# Altium project nfc-epd.PrjPcb
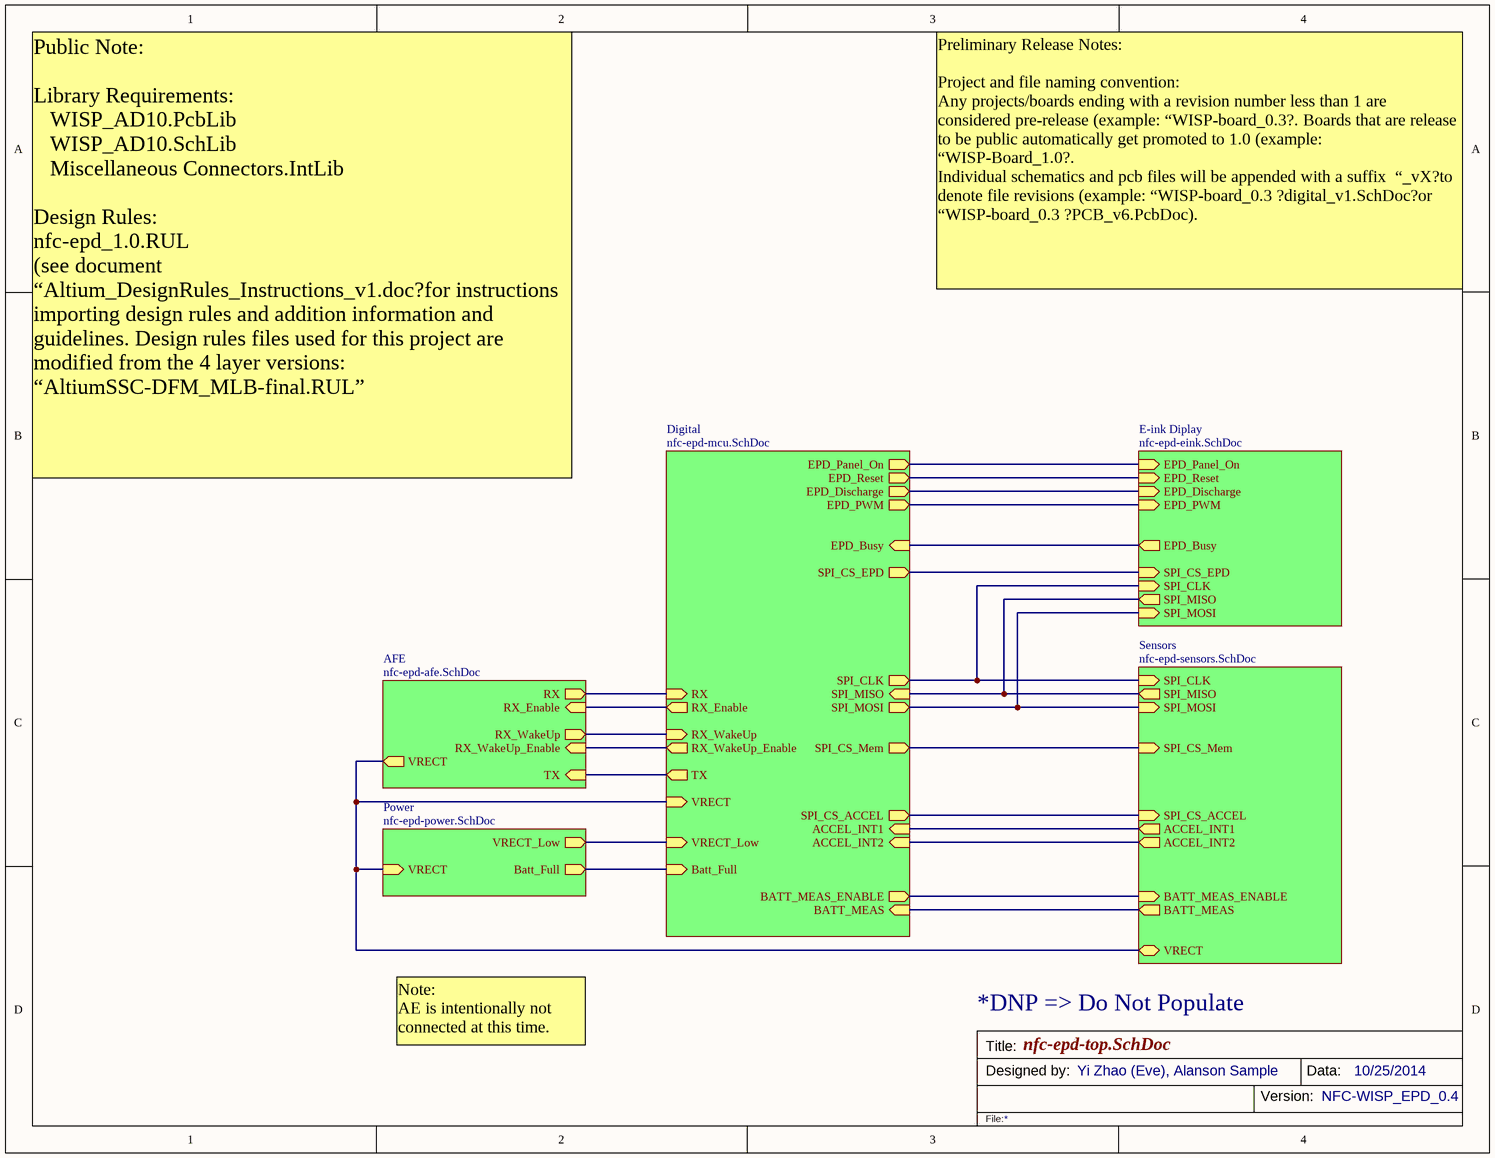
[diagram p0: nfc-epd-top.SchDoc]
6 sheets, 142 parts. Net scope: hierarchical (ports join the sheet entries above them; power ports are global).
Board file: nfc-epd.PcbDoc
Sheets:
  nfc-epd-top.SchDoc
    Digital = nfc-epd-mcu.SchDoc
    Sensors = nfc-epd-sensors.SchDoc
    Power = nfc-epd-power.SchDoc
    AFE = nfc-epd-afe.SchDoc
    E-ink Diplay = nfc-epd-eink.SchDoc

## Sheet nfc-epd-top.SchDoc
size Letter

### Sub-sheets
AFE = nfc-epd-afe.SchDoc: RX (out), TX (in), RX_Enable (in), RX_WakeUp (out), RX_WakeUp_Enable (in), VRECT (out)
Digital = nfc-epd-mcu.SchDoc: RX (in), TX (out), RX_Enable (out), SPI_MOSI (out), SPI_MISO (in), SPI_CLK (out), RX_WakeUp (in), RX_WakeUp_Enable (out), VRECT_Low (in), BATT_MEAS_ENABLE (out), BATT_MEAS (in), SPI_CS_EPD (out), EPD_Busy (in), EPD_Reset (out), EPD_Panel_On (out), EPD_Discharge (out), EPD_PWM (out), SPI_CS_Mem (out), Batt_Full (in), VRECT (in), ACCEL_INT1 (in), ACCEL_INT2 (in), SPI_CS_ACCEL (out)
E-ink Diplay = nfc-epd-eink.SchDoc: SPI_CS_EPD (in), EPD_Busy (out), SPI_CLK (in), SPI_MOSI (in), SPI_MISO (out), EPD_Reset (in), EPD_Panel_On (in), EPD_Discharge (in), EPD_PWM (in)
Power = nfc-epd-power.SchDoc: VRECT_Low (out), VRECT (in), Batt_Full (out)
Sensors = nfc-epd-sensors.SchDoc: VRECT, BATT_MEAS_ENABLE (in), BATT_MEAS (out), SPI_MOSI (in), SPI_MISO (out), SPI_CS_Mem (in), SPI_CLK (in), SPI_CS_ACCEL (in), ACCEL_INT1 (out), ACCEL_INT2 (out)

### Nets
ACCEL_INT1: sheet Digital/ACCEL_INT1, sheet Sensors/ACCEL_INT1
ACCEL_INT2: sheet Digital/ACCEL_INT2, sheet Sensors/ACCEL_INT2
Batt_Full: sheet Digital/Batt_Full, sheet Power/Batt_Full
BATT_MEAS: sheet Digital/BATT_MEAS, sheet Sensors/BATT_MEAS
BATT_MEAS_ENABLE: sheet Digital/BATT_MEAS_ENABLE, sheet Sensors/BATT_MEAS_ENABLE
EPD_Busy: sheet Digital/EPD_Busy, sheet E-ink Diplay/EPD_Busy
EPD_Discharge: sheet Digital/EPD_Discharge, sheet E-ink Diplay/EPD_Discharge
EPD_Panel_On: sheet Digital/EPD_Panel_On, sheet E-ink Diplay/EPD_Panel_On
EPD_PWM: sheet Digital/EPD_PWM, sheet E-ink Diplay/EPD_PWM
EPD_Reset: sheet Digital/EPD_Reset, sheet E-ink Diplay/EPD_Reset
RX: sheet Digital/RX, sheet AFE/RX
RX_ENABLE: sheet Digital/RX_Enable, sheet AFE/RX_Enable
RX_WakeUp: sheet Digital/RX_WakeUp, sheet AFE/RX_WakeUp
RX_WakeUp_Enable: sheet Digital/RX_WakeUp_Enable, sheet AFE/RX_WakeUp_Enable
SPI_CLK: sheet Digital/SPI_CLK, sheet Sensors/SPI_CLK, sheet E-ink Diplay/SPI_CLK
SPI_CS_ACCEL: sheet Digital/SPI_CS_ACCEL, sheet Sensors/SPI_CS_ACCEL
SPI_CS_EPD: sheet Digital/SPI_CS_EPD, sheet E-ink Diplay/SPI_CS_EPD
SPI_CS_Mem: sheet Digital/SPI_CS_Mem, sheet Sensors/SPI_CS_Mem
SPI_MISO: sheet Digital/SPI_MISO, sheet Sensors/SPI_MISO, sheet E-ink Diplay/SPI_MISO
SPI_MOSI: sheet Digital/SPI_MOSI, sheet Sensors/SPI_MOSI, sheet E-ink Diplay/SPI_MOSI
TX: sheet Digital/TX, sheet AFE/TX
VRECT: sheet Digital/VRECT, sheet Sensors/VRECT, sheet Power/VRECT, sheet AFE/VRECT
VRECT_Low: sheet Digital/VRECT_Low, sheet Power/VRECT_Low

### Notes on the sheet
- Preliminary Release Notes:
  Project and file naming convention:
  Any projects/boards ending with a revision number less than 1 are considered pre-release (example: “WISP-board_0.3?. Boards that are release to be public automatically get promoted to 1.0 (example: “WISP-Board_1.0?.
  Individual schematics and pcb files will be appended with a suffix  “_vX?to denote file revisions (example: “WISP-board_0.3 ?digital_v1.SchDoc?or “WISP-board_0.3 ?PCB_v6.PcbDoc).
- Public Note:
  Library Requirements:
  WISP_AD10.PcbLib
  WISP_AD10.SchLib
  Miscellaneous Connectors.IntLib
  Design Rules:
  nfc-epd_1.0.RUL
  (see document “Altium_DesignRules_Instructions_v1.doc?for instructions importing design rules and addition information and guidelines. Design rules files used for this project are modified from the 4 layer versions:  “AltiumSSC-DFM_MLB-final.RUL”
- Note:
  AE is intentionally not connected at this time.
- *DNP => Do Not Populate
- Title:
- Designed by:
- Yi Zhao (Eve), Alanson Sample
- Version:
- Data:
- NFC-WISP_EPD_0.4
- 10/25/2014
- File:

## Sheet nfc-epd-mcu.SchDoc
size Letter
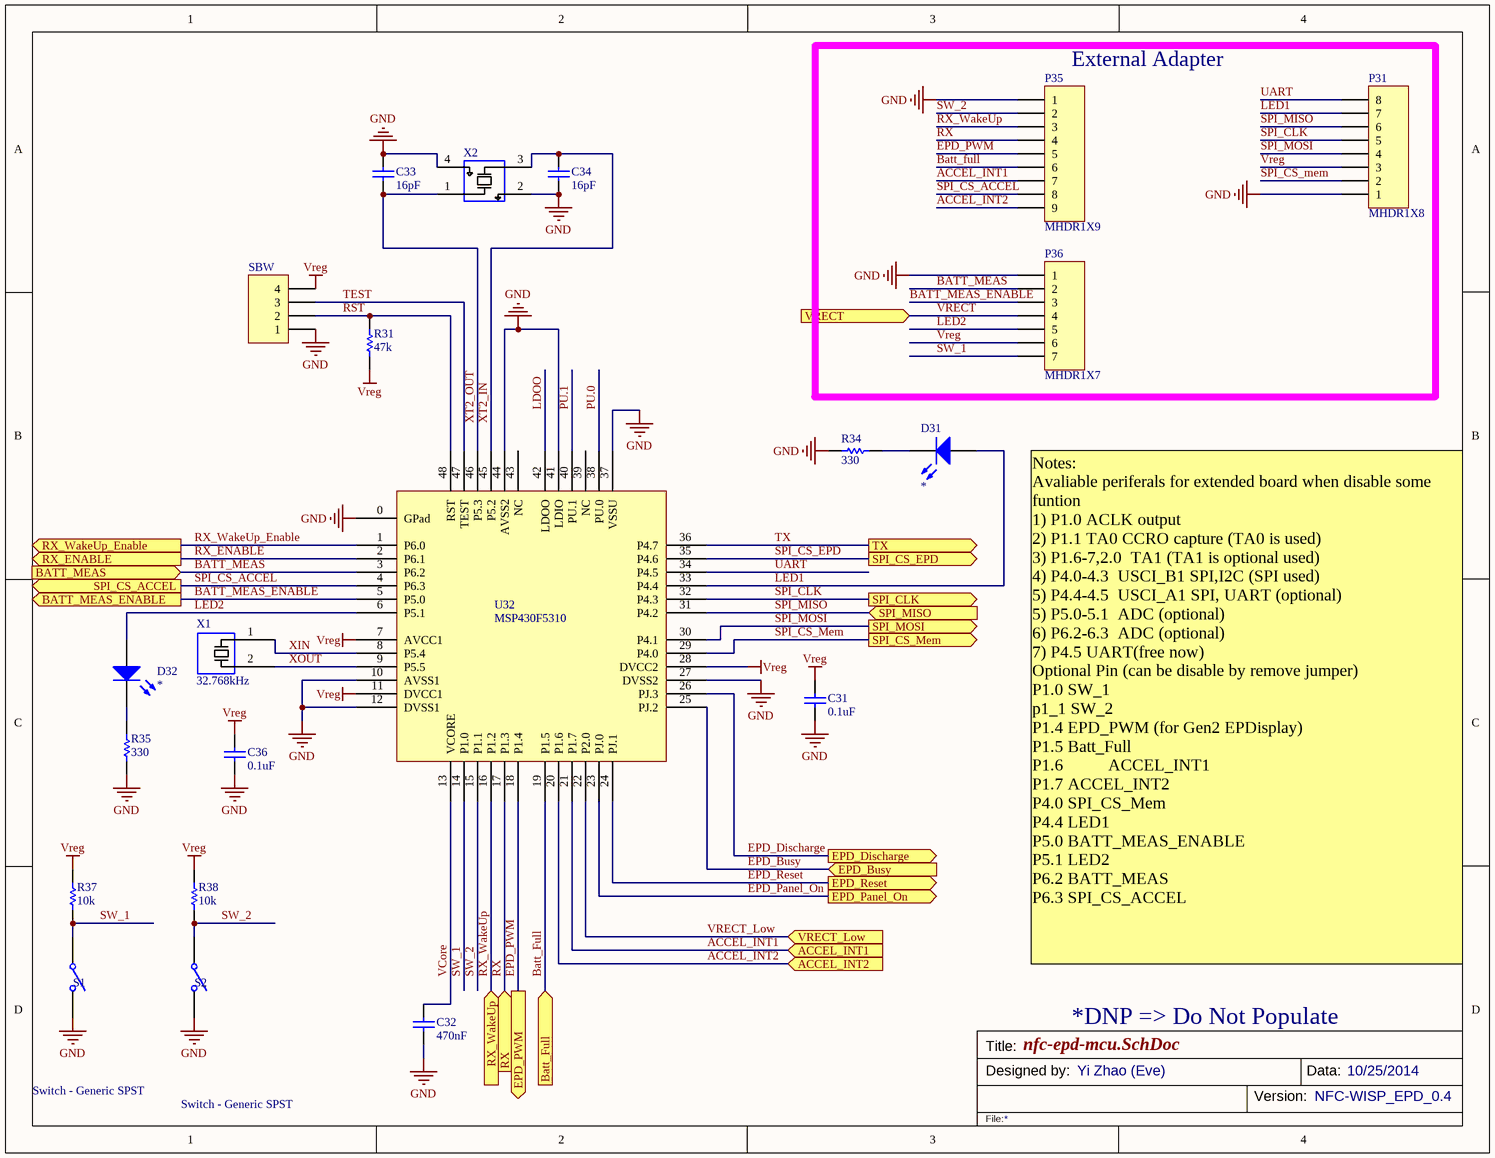
[diagram p1: nfc-epd-mcu.SchDoc]

### Parts
C31  value 0.1uF  [0603]  (hidden comment: Cap)
C32  value 470nF  [0603]  (hidden comment: Cap)
C33  value 16pF  [0603]  (hidden comment: Cap)
C34  value 16pF  [0603]  (hidden comment: Cap)
C36  value 0.1uF  [0402]  (hidden comment: Cap)
D31  LED  [Diode - 0603]  (value not drawn)
D32  LED  [Diode - 0603]  (value not drawn)
P31  MHDR1X8  [MHDR1X8]
P35  MHDR1X9  [MHDR1X9]
P36  MHDR1X7  [MHDR1X7]
R31  value 47k  [0603]  (hidden comment: Res)
R34  value 330  [0603]  (hidden comment: Res)
R35  value 330  [0603]  (hidden comment: Res)
R37  value 10k  [0603]  (hidden comment: Res)
R38  value 10k  [0603]  (hidden comment: Res)
S1  Switch - Generic SPST  [Switch - B3U-1000P]
S2  Switch - Generic SPST  [Switch - B3U-1000P]
SBW  MHDR1X4  [MHDR1X4]  (value not drawn)
U32  MSP430F5310  [48-QFN]
X1  value 32.768kHz  [XTAL - 2Pin [3.2mm x 1.5mm]]  (hidden comment: XTAL)
X2  XTAL 4pin  [XTAL - 4Pin [3.2MM X 2.5MM]]  (value not drawn)

### Blocks framed on the sheet
External Adapter: P31 P35 P36

### Ports
ACCEL_INT1 (in), ACCEL_INT2 (in), Batt_Full (in), BATT_MEAS (in), BATT_MEAS_ENABLE (out), EPD_Busy (in), EPD_Discharge (out), EPD_Panel_On (out), EPD_PWM (out), EPD_Reset (out), RX (in), RX_ENABLE (out), RX_WakeUp (in), RX_WakeUp_Enable (out), SPI_CLK (out), SPI_CS_ACCEL (out), SPI_CS_EPD (out), SPI_CS_Mem (out), SPI_MISO (in), SPI_MOSI (out), TX (out), VRECT (in), VRECT_Low (in)

### Nets
GND: C31.1 C32.2 C33.2 C34.1 C36.1 P31.1 P35.1 P36.1 R34.1 R35.1 S1.2(NO) S2.2(NO) SBW.1 U32.0(GPad) U32.10(AVSS1) U32.12(DVSS1) U32.27(DVSS2) U32.37(VSSU) U32.41(LDIO) U32.44(AVSS2) X2.2(Gnd) X2.4(Gnd)
Vreg: C31.2 C36.2 P31.3 P36.6 R31.2 R37.2 R38.2 SBW.4 U32.7(AVCC1) U32.11(DVCC1) U32.28(DVCC2)
ACCEL_INT1: P35.7 U32.21(P1.7) ; port ACCEL_INT1
ACCEL_INT2: P35.9 U32.20(P1.6) ; port ACCEL_INT2
Batt_Full: P35.6 U32.19(P1.5) ; port Batt_Full
BATT_MEAS: P36.2 U32.3(P6.2) ; port BATT_MEAS
BATT_MEAS_ENABLE: P36.3 U32.5(P5.0) ; port BATT_MEAS_ENABLE
EPD_Busy: U32.25(PJ.2) ; port EPD_Busy
EPD_Discharge: U32.26(PJ.3) ; port EPD_Discharge
EPD_Panel_On: U32.23(PJ.0) ; port EPD_Panel_On
EPD_PWM: P35.5 U32.18(P1.4) ; port EPD_PWM
EPD_Reset: U32.24(PJ.1) ; port EPD_Reset
LDOO: U32.42(LDOO)
LED1: D31.1(A) P31.7 U32.33(P4.4)
LED2: D32.1(A) P36.5 U32.6(P5.1)
PU.0: U32.38(PU.0)
PU.1: U32.40(PU.1)
RST: R31.1 SBW.2 U32.48(RST)
RX: P35.4 U32.17(P1.3) ; port RX
RX_ENABLE: U32.2(P6.1) ; port RX_ENABLE
RX_WakeUp: P35.3 U32.16(P1.2) ; port RX_WakeUp
RX_WakeUp_Enable: U32.1(P6.0) ; port RX_WakeUp_Enable
SPI_CLK: P31.5 U32.32(P4.3) ; port SPI_CLK
SPI_CS_ACCEL: P35.8 U32.4(P6.3) ; port SPI_CS_ACCEL
SPI_CS_EPD: U32.35(P4.6) ; port SPI_CS_EPD
SPI_CS_Mem: P31.2 U32.29(P4.0) ; port SPI_CS_Mem
SPI_MISO: P31.6 U32.31(P4.2) ; port SPI_MISO
SPI_MOSI: P31.4 U32.30(P4.1) ; port SPI_MOSI
SW_1: P36.7 R37.1 S1.1(COMMON) U32.14(P1.0)
SW_2: P35.2 R38.1 S2.1(COMMON) U32.15(P1.1)
TEST: SBW.3 U32.47(TEST)
TX: U32.36(P4.7) ; port TX
UART: P31.8 U32.34(P4.5)
VCore: C32.1 U32.13(VCORE)
VRECT: P36.4 ; port VRECT
VRECT_Low: U32.22(P2.0) ; port VRECT_Low
XIN: U32.8(P5.4) X1.1
XOUT: U32.9(P5.5) X1.2
XT2_IN: C34.2 U32.45(P5.2) X2.3(XOUT)
XT2_OUT: C33.1 U32.46(P5.3) X2.1(XIN)
NetD31_2: D31.2(K) R34.2
NetD32_2: D32.2(K) R35.2

Not connected (* = marked no-connect by the designer): U32 39(NC) 43(NC)

### Notes on the sheet
- Notes:
  Avaliable periferals for extended board when disable some funtion
  1) P1.0	ACLK output
  2) P1.1	TA0 CCRO capture (TA0 is used)
  3) P1.6-7,2.0  TA1 (TA1 is optional used)
  4) P4.0-4.3	 USCI_B1 SPI,I2C (SPI used)
  5) P4.4-4.5  USCI_A1 SPI, UART (optional)
  5) P5.0-5.1  ADC (optional)
  6) P6.2-6.3  ADC (optional)
  7) P4.5	UART(free now)
  Optional Pin (can be disable by remove jumper)
  P1.0	SW_1
  p1_1	SW_2
  P1.4	EPD_PWM (for Gen2 EPDisplay)
  P1.5	Batt_Full
  P1.6          ACCEL_INT1
  P1.7	ACCEL_INT2
  P4.0	SPI_CS_Mem
  P4.4	LED1
  P5.0	BATT_MEAS_ENABLE
  P5.1	LED2
  P6.2	BATT_MEAS
  P6.3	SPI_CS_ACCEL
- *DNP => Do Not Populate
- Title:
- Designed by:
- Yi Zhao (Eve)
- Version:
- Data:
- NFC-WISP_EPD_0.4
- 10/25/2014
- File:

### Library data of the parts
C31-C34 C36 = Cap: Ceramic Capacitor (Surface Mount); Manufacturer: Generic Ceramic Chip Cap (TBD); Digi-Key Part Number: *; Manufacturer Part Number: *; Note: *; Rating: *
D31 D32 = Diode - LED: Typical RED, GREEN, YELLOW, AMBER GaAs LED; Digi-Key Part Number: *; Manufacturer: *; Manufacturer Part Number: *; Note: *; Value: *; Rating: *
P31 = MHDR1X8: Header, 8-Pin; Manufacturer Part Number 1: 0603ZD105KAT2A; Note: DNP; LatestRevisionDate: 17-Jul-2002; LatestRevisionNote: Re-released for DXP Platform.; Publisher: Altium Limited
P35 = MHDR1X9: Header, 9-Pin; Note: DNP; LatestRevisionDate: 17-Jul-2002; LatestRevisionNote: Re-released for DXP Platform.; Publisher: Altium Limited
P36 = MHDR1X7: Header, 7-Pin; Note: DNP; LatestRevisionDate: 17-Jul-2002; LatestRevisionNote: Re-released for DXP Platform.; Publisher: Altium Limited
R31 R34 R35 R37 R38 = Res: Chip Resistor (Surface Mount); Manufacturer: Generic Chip Res (TBD); Manufacturer Part Number: *; Digi-Key Part Number: *; Rating: *; Note: *
S1 S2 = Switch - Generic SPST: Generic Single-Pole, Single-Throw Switch; Manufacturer: *; Digi-Key Part Number: *; Manufacturer Part Number: *; Note: *; Value: *; Rating: *; Supplier 1: Digi-Key; Supplier Part Number 1: SW1143CT-ND
SBW = MHDR1X4: Header, 4-Pin; LatestRevisionDate: 17-Jul-2002; LatestRevisionNote: Re-released for DXP Platform.; Publisher: Altium Limited
U32 = MSP430F5310 - 48Pin: MSP430 - 48LQFP or 48QFN; Manufacturer: Texas Instruments; Manufacturer Part Number: MSP430F5310IRGZ; Digi-Key Part Number: 296-28193-2-ND or 296-28133-1-ND; Rating: *; Value: *; Note: *; Supplier 1: Digi-Key; Supplier Part Number 1: 296-28133-1-ND
X1 = XTAL 2-pins: Crystal - 2-Pin Surface Mount; Manufacturer: Epson Toyocom Corporation; Manufacturer Part Number: FC-135 32.7680KA-A3; Digi-Key Part Number: example: SE2413CT-ND
X2 = XTAL 4-pins: Crystal - 4-Pin Surface Mount; Manufacturer Part Number 1: ABM8G-13.560MHZ-B4Y-T; Note: double check foot print; Rating: *; Value: *; Supplier 1: Digi-Key; Supplier Part Number 1: 535-10286-1-ND

## Sheet nfc-epd-sensors.SchDoc
size A
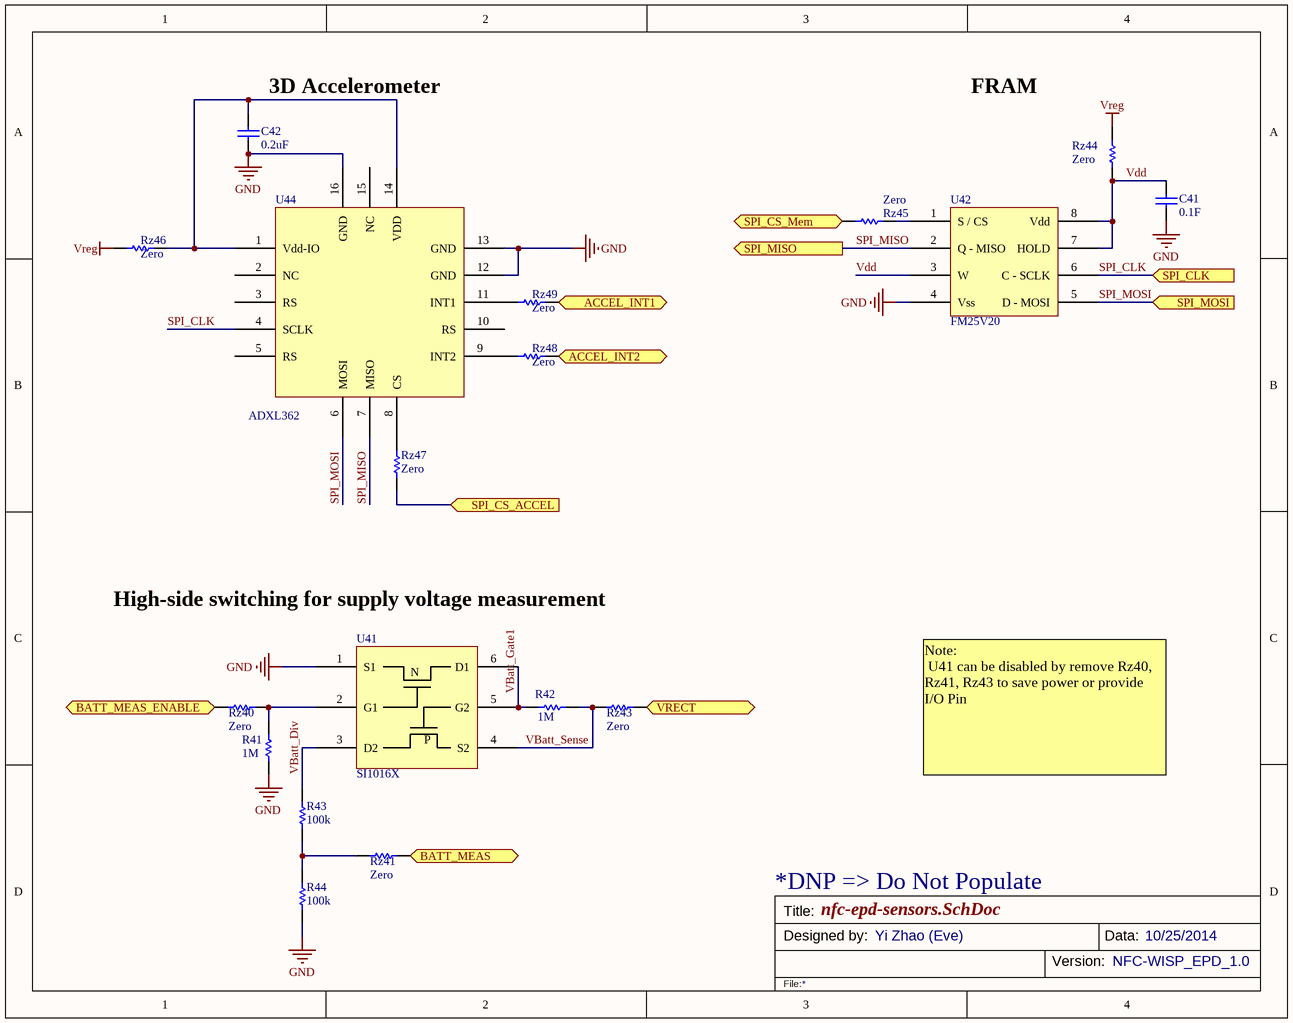
[diagram p2: nfc-epd-sensors.SchDoc]

### Parts
C41  value 0.1F  [0603]  (hidden comment: Cap)
C42  value 0.2uF  [0402]  (hidden comment: Cap)
R41  value 1M  [0603]  (hidden comment: Res)
R42  value 1M  [0603]  (hidden comment: Res)
R43  value 100k  [0603]  (hidden comment: Res)
R44  value 100k  [0603]  (hidden comment: Res)
Rz40  value Zero  [0603]  (hidden comment: Res)
Rz41  value Zero  [0603]  (hidden comment: Res)
Rz43  value Zero  [0603]  (hidden comment: Res)
Rz44  value Zero  [0603]  (hidden comment: Res)
Rz45  value Zero  [0603]  (hidden comment: Res)
Rz46  value Zero  [0603]  (hidden comment: Res)
Rz47  value Zero  [0603]  (hidden comment: Res)
Rz48  value Zero  [0603]  (hidden comment: Res)
Rz49  value Zero  [0603]  (hidden comment: Res)
U41  SI1016X  [SC-89-6 Vishay]
U42  FM25V20  [TDFN-8]
U44  ADXL362  [ADXL362 - Mod 6mil clearence]

### Ports
ACCEL_INT1 (out), ACCEL_INT2 (out), BATT_MEAS (out), BATT_MEAS_ENABLE (in), SPI_CLK (in), SPI_CS_ACCEL (in), SPI_CS_Mem (in), SPI_MISO (out), SPI_MOSI (in), VRECT (in)

### Nets
GND: C41.1 C42.2 R41.1 R44.1 U41.1(S1) U42.4(Vss) U44.12(GND) U44.13(GND) U44.16(GND)
Vreg: Rz44.1 Rz46.1
ACCEL_INT1: Rz49.2 ; port ACCEL_INT1
ACCEL_INT2: Rz48.2 ; port ACCEL_INT2
BATT_MEAS: Rz41.1 ; port BATT_MEAS
BATT_MEAS_ENABLE: Rz40.2 ; port BATT_MEAS_ENABLE
SPI_CLK: U42.6(C_-_SCLK) U44.4(SCLK) ; port SPI_CLK
SPI_CS_ACCEL: Rz47.1 ; port SPI_CS_ACCEL
SPI_CS_Mem: Rz45.1 ; port SPI_CS_Mem
SPI_MISO: U42.2(Q_-_MISO) U44.7(MISO) ; port SPI_MISO
SPI_MOSI: U42.5(D_-_MOSI) U44.6(MOSI) ; port SPI_MOSI
VBatt_Div: R43.2 U41.3(D2)
VBatt_Gate1: R42.2 U41.5(G2) U41.6(D1)
VBatt_Sense: R42.1 Rz43.2 U41.4(S2)
Vdd: C41.2 Rz44.2 U42.3(W) U42.7(HOLD) U42.8(Vdd)
VRECT: Rz43.1 ; port VRECT
NetC42_1: C42.1 Rz46.2 U44.1(Vdd-IO) U44.14(VDD)
NetR41_2: R41.2 Rz40.1 U41.2(G1)
NetR43_1: R43.1 R44.2 Rz41.2
NetRz45_2: Rz45.2 U42.1(S_/_CS)
NetRz47_2: Rz47.2 U44.8(CS)
NetRz48_1: Rz48.1 U44.9(INT2)
NetRz49_1: Rz49.1 U44.11(INT1)

Not connected (* = marked no-connect by the designer): U44 2(NC) 3(RS) 5(RS) 10(RS) 15(NC)

### Notes on the sheet
- (near C42) 3D Accelerometer
- FRAM
- High-side switching for supply voltage measurement
- Note:
  U41 can be disabled by remove Rz40, Rz41, Rz43 to save power or provide I/O Pin
- *DNP => Do Not Populate
- Title:
- Designed by:
- Yi Zhao (Eve)
- Version:
- Data:
- NFC-WISP_EPD_1.0
- 10/25/2014
- File:
- (in symbol SI1016X) N; P

### Library data of the parts
C41 C42 = Cap: as C31 on sheet nfc-epd-mcu; Digi-Key Part Number: *; Manufacturer Part Number: *; Note: *; Rating: *
R41-R44 = Res: as R31 on sheet nfc-epd-mcu; Manufacturer Part Number: *; Digi-Key Part Number: *; Rating: *; Note: *
Rz40 Rz41 Rz43-Rz49 = Res: Chip Resistor (Surface Mount); Manufacturer: Generic Chip Res (TBD); Manufacturer Part Number: RC0603FR-070RL; Note: DNP; Digi-Key Part Number: *; Rating: *; Supplier 1: Digi-Key; Supplier Part Number 1: 311-0.0HRCT-ND
U41 = SI1016X: NMOS and PMOS array; Manufacturer: Vishay Siliconix; Manufacturer Part Number: SI1016X-T1-GE3; Digi-Key Part Number: SI1016X-T1-GE3CT-ND; Note: *; Value: *; Rating: *; Supplier 1: Digi-Key; Supplier Part Number 1: SI1016X-T1-GE3CT-ND
U42 = FM25V20: ? Mbit FRAM SPI; Manufacturer: Cypress Semiconductor Corp; Digi-Key Part Number: 428-3214-ND; Manufacturer Part Number: FM25V20; Rating: *; Note: *; Supplier 1: Digi-Key
U44 = ADXL362: 3D ACCEL DIG LO PWR 16LGA; Manufacturer: Analog Devices Inc; Manufacturer Part Number: ADXL362BCCZ-R2; Digi-Key Part Number: ADXL362BCCZ-R2CT-ND; Value: *; Rating: *; Note: *; Supplier 1: Digi-Key; Supplier Part Number 1: ADXL362BCCZ-R2CT-ND

## Sheet nfc-epd-power.SchDoc
size A
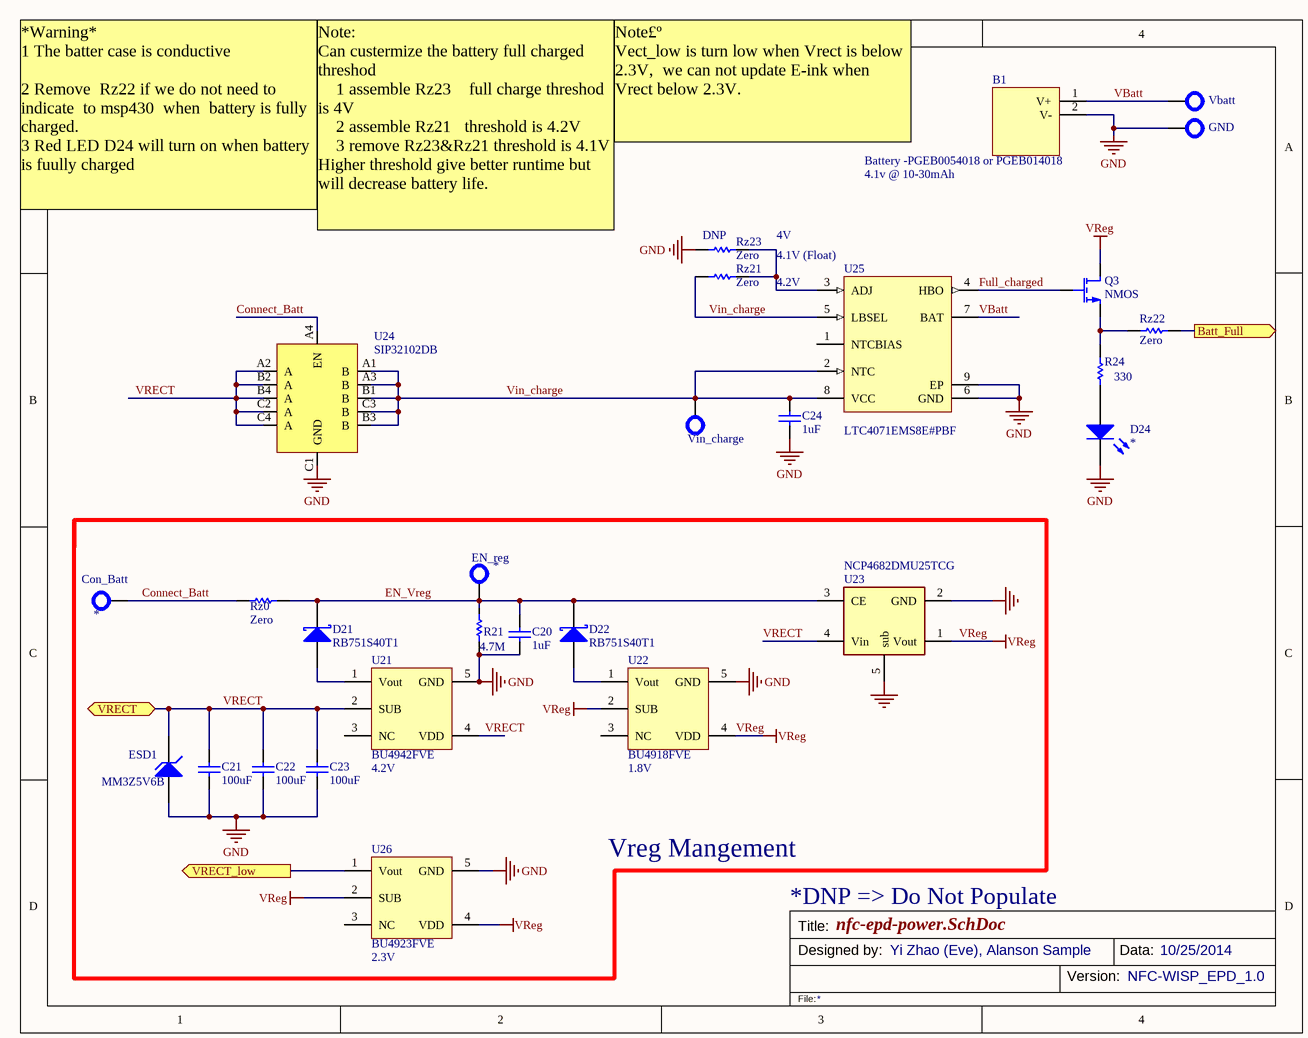
[diagram p3: nfc-epd-power.SchDoc]

### Parts
B1  Battery -PGEB0054018 or PGEB014018  value 4.1v @ 10-30mAh  [Battery -PGEB0054018-Pad_only]
C20  value 1uF  [0603]  (hidden comment: Cap)
C21  value 100uF  [1206]  (hidden comment: Cap)
C22  value 100uF  [1206]  (hidden comment: Cap)
C23  value 100uF  [1206]  (hidden comment: Cap)
C24  value 1uF  [0603]  (hidden comment: Cap)
Con_Batt  Test Point  [Test Point - Super Small]  (value not drawn)
D21  RB751S40T1  [SOD-523]
D22  RB751S40T1  [SOD-523]
D24  LED  [Diode - 0603]  (value not drawn)
EN_reg  Test Point  [Test Point - Small]  (value not drawn)
ESD1  MM3Z5V6B  [SOD-323]
GND1  GND  [Test Point - Super Small]
Q3  NMOS  [SOT-323 / SC-70]
R21  value 4.7M  [0603]  (hidden comment: Res)
R24  value 330  [0603]  (hidden comment: Res)
Rz0  value Zero  [0603]  (hidden comment: Res)
Rz21  value Zero  [0603]  (hidden comment: Res)
Rz22  value Zero  [0603]  (hidden comment: Res)
Rz23  value Zero  Note: DNP  [0603]  (hidden comment: Res)
U21  BU4942FVE  value 4.2V  [VSOF5/SOT665]
U22  BU4918FVE  value 1.8V  [VSOF5/SOT665]
U23  NCP4682DMU25TCG  [4-UDFN]
U24  SIP32102DB  [WCSP-12]
U25  LTC4071EMS8E#PBF  [LT-MS8E-8-1880X1680TP_N]
U26  BU4923FVE  Vaule: 2.3V  [VSOF5/SOT665]
Vbatt  Vbatt  [Test Point - Super Small]  (value not drawn)
Vin_charge  Test Point  [Test Point - Super Small]  (value not drawn)

### Blocks framed on the sheet
Vreg Mangement: C20-C23 Con_Batt D21 D22 EN_reg ESD1 R21 Rz0 U21-U23 U26

### Ports
Batt_Full (out), VRECT, VRECT_low (out)

### Nets
GND: B1.2(V-) C20.1 C21.1 C22.1 C23.1 C24.1 D24.2(K) ESD1.1(A) GND1.0 R21.1 Rz23.2 U21.5(GND) U22.5(GND) U23.2(GND) U23.5(sub) U24.C1(GND) U25.6(GND) U25.9(EP) U26.5(GND)
Vreg: Q3.3(D) U22.2(SUB) U22.4(VDD) U23.1(Vout) U26.2(SUB) U26.4(VDD)
Batt_Full: Rz22.1 ; port Batt_Full
Connect_Batt: Con_Batt.0 Rz0.2 U24.A4(EN)
EN_Vreg: C20.2 D21.2(C) D22.2(C) EN_reg.0 R21.2 Rz0.1 U23.3(CE)
Full_charged: Q3.1(G) U25.4(HBO)
VBatt: B1.1(V+) U25.7(BAT) Vbatt.0
Vin_charge: C24.2 Rz21.2 U24.A1(B) U24.A3(B) U24.B1(B) U24.B3(B) U24.C3(B) U25.2(NTC) U25.5(LBSEL) U25.8(VCC) Vin_charge.0
VRECT: C21.2 C22.2 C23.2 ESD1.2(C) U21.2(SUB) U21.4(VDD) U23.4(Vin) U24.A2(A) U24.B2(A) U24.B4(A) U24.C2(A) U24.C4(A) ; port VRECT
VRECT_Low: U26.1(Vout) ; port VRECT_low
NetD21_1: D21.1(A) U21.1(Vout)
NetD22_1: D22.1(A) U22.1(Vout)
NetD24_1: D24.1(A) R24.2
NetQ3_2: Q3.2(S) R24.1 Rz22.2
NetRz21_1: Rz21.1 Rz23.1 U25.3(ADJ)

Not connected (* = marked no-connect by the designer): U21 3(NC); U22 3(NC); U25 1(NTCBIAS); U26 3(NC)

### Notes on the sheet
- Note£º
  Vect_low is turn low when Vrect is below 2.3V,  we can not update E-ink when Vrect below 2.3V.
- *Warning*
  1 The batter case is conductive
  2 Remove  Rz22 if we do not need to indicate  to msp430  when  battery is fully charged.
  3 Red LED D24 will turn on when battery is fuully charged
- Note:
  Can custermize the battery full charged threshod
  1 assemble Rz23    full charge threshod is 4V
  2 assemble Rz21   threshold is 4.2V
  3 remove Rz23&Rz21 threshold is 4.1V
  Higher threshold give better runtime but will decrease battery life.
- 4V
- 4.2V
- 4.1V (Float)
- *DNP => Do Not Populate
- Title:
- Designed by:
- Yi Zhao (Eve), Alanson Sample
- Version:
- Data:
- NFC-WISP_EPD_1.0
- 10/25/2014
- File:

### Library data of the parts
B1 = Battery - MEC201: ThinFilm solid state battery  - 4.1V 1.0MAH; Manufacturer Part Number: MEC201-10S (several in same formfactor); Manufacturer: Infinite Power Solutions; Rating: *R; Note: DNP; Digi-Key Part Number: MEC201-10SCT-ND (several in same formfactor)
C20 C24 = Cap: Ceramic Capacitor (Surface Mount); Manufacturer: Generic Ceramic Chip Cap (TBD); Manufacturer Part Number 1: 0603ZD105KAT2A; Supplier Part Number 1: 478-1251-1-1ND; Note: *; Rating: *; Supplier 1: Digi-Key
C21-C23 = Cap: as C31 on sheet nfc-epd-mcu; Digi-Key Part Number: *; Manufacturer Part Number: *; Note: *; Rating: *
Con_Batt EN_reg GND1 Vbatt Vin_charge = Test Point: Test Point, large or small foot prints; Manufacturer Part Number: Example: 5000, 5013; Manufacturer: Keystone Electronics; Digi-Key Part Number: Example: 5000K-ND, 5012K-ND, Surface mount 5015KCT-ND; Note: *; Rating: *; Value: *
D21 D22 = RB751S40T1: Schottky Diode; Published: 8-Jun-2000; LatestRevisionDate: 17-Jul-2002; LatestRevisionNote: Re-released for DXP Platform.; PackageReference: SMB; Publisher: Altium Limited; Code_JEDEC: DO-214-AA
D24 = Diode - LED: as D31 on sheet nfc-epd-mcu; Digi-Key Part Number: *; Manufacturer: *; Manufacturer Part Number: *; Note: *; Value: *; Rating: *
ESD1 = MM3Z4V3B: Vz=5.6V, Overvoltage Protection Zener; Manufacturer: Fairchild; Manufacturer Part Number: MM3Z5V6B; Digi-Key Part Number: MM3Z5V6BCT-ND; Value: *; Rating: *; Note: *; Supplier 1: Digi-Key; Supplier Part Number 1: MM3Z5V6BCT-ND
Q3 = MOSFET-N: N-Channel MOSFET; Digi-Key Part Number: *; Manufacturer Part Number: *; Manufacturer: *; Notes: *; Rating: *; Value: NMOS
R21 R24 = Res: as R31 on sheet nfc-epd-mcu; Manufacturer Part Number: *; Digi-Key Part Number: *; Rating: *; Note: *
Rz0 Rz21-Rz23 = Res: Chip Resistor (Surface Mount); Manufacturer: Generic Chip Res (TBD); Manufacturer Part Number: RC0603FR-070RL; Digi-Key Part Number: *; Rating: *; Supplier 1: Digi-Key; Supplier Part Number 1: 311-0.0HRCT-ND
U21 U22 U26 = BU49xxFVE: VSOF-5,Supervisor; Digi-Key Part Number: *; Distributor: *; Distributor Part Number: *; Manufacture: *; Manufacture Part Number: *; Note: *; Rating: *; Supplier 1: Digi-Key
  U21: Supplier Part Number 1: BU4942FVE-TR-ND
  U22: Supplier Part Number 1: BU4918FVE-TR-ND
  U26: Supplier Part Number 1: BU4923FVE-TR-ND
U23 = NCP4682DMU25TCG: Regulator: LDO  NCP4682 (with enable), 4-UDFN package; Manufacturer: ON Semiconductor; Digi-Key Part Number: NCP4682DMU25TCGOSCT-ND; Manufacturer Part Number: NCP4682DMU25TCG; Rating: *; Value: *; Note: *; Supplier 1: Digi-Key; Supplier Part Number 1: NCP4682DMU25TCGOSCT-ND
U24 = SIP32102DB: Bi-directional Load Switch; Supplier 1: Digi-Key; Supplier Part Number 1: SIP32102DB-T1-GE1CT-ND
U25 = LTC4071EMS8E#PBF: Li-Ion / Polymer Shunt Battery Charger System with Low Battery Disconnect, 8-pin SOP (MS8E-8), -40 to 125 degC, Pb-Free; Manufacturer: Linear Technology; Number of Outputs: 1; DatasheetVersion: Rev. C; PackageVersion: Rev. F; PackageReference: MS8E-8; PackageDescription: 8-Pin Plastic MSOP, Exposed Die Pad, Body 3 x 3 mm, Pitch 0.65 mm; Supplier 1: Digi-Key; Supplier Part Number 1: LTC4071EMS8E#PBF-ND; Supplier 2: Farnell; Supplier Part Number 2: 1947919; Supplier 3: Newark; Supplier Part Number 3: 13T8411; RoHS: TRUE; Topology: Shunt Battery Charger; Mounting Technology: Surface Mount; PartNumber: LTC4071EMS8E#PBF; ComponentLink1Description: Manufacturer URL; ComponentLink1URL: http://www.linear.com/; ComponentLink2Description: Datasheet; ComponentLink2URL: http://cds.linear.com/docs/en/datasheet/4071fc.pdf; ComponentLink3Description: Package Specification; ComponentLink3URL: http://cds.linear.com/docs/en/datasheet/3080fc.pdf

## Sheet nfc-epd-afe.SchDoc
size Letter; CurrentDate: 10/10/2014
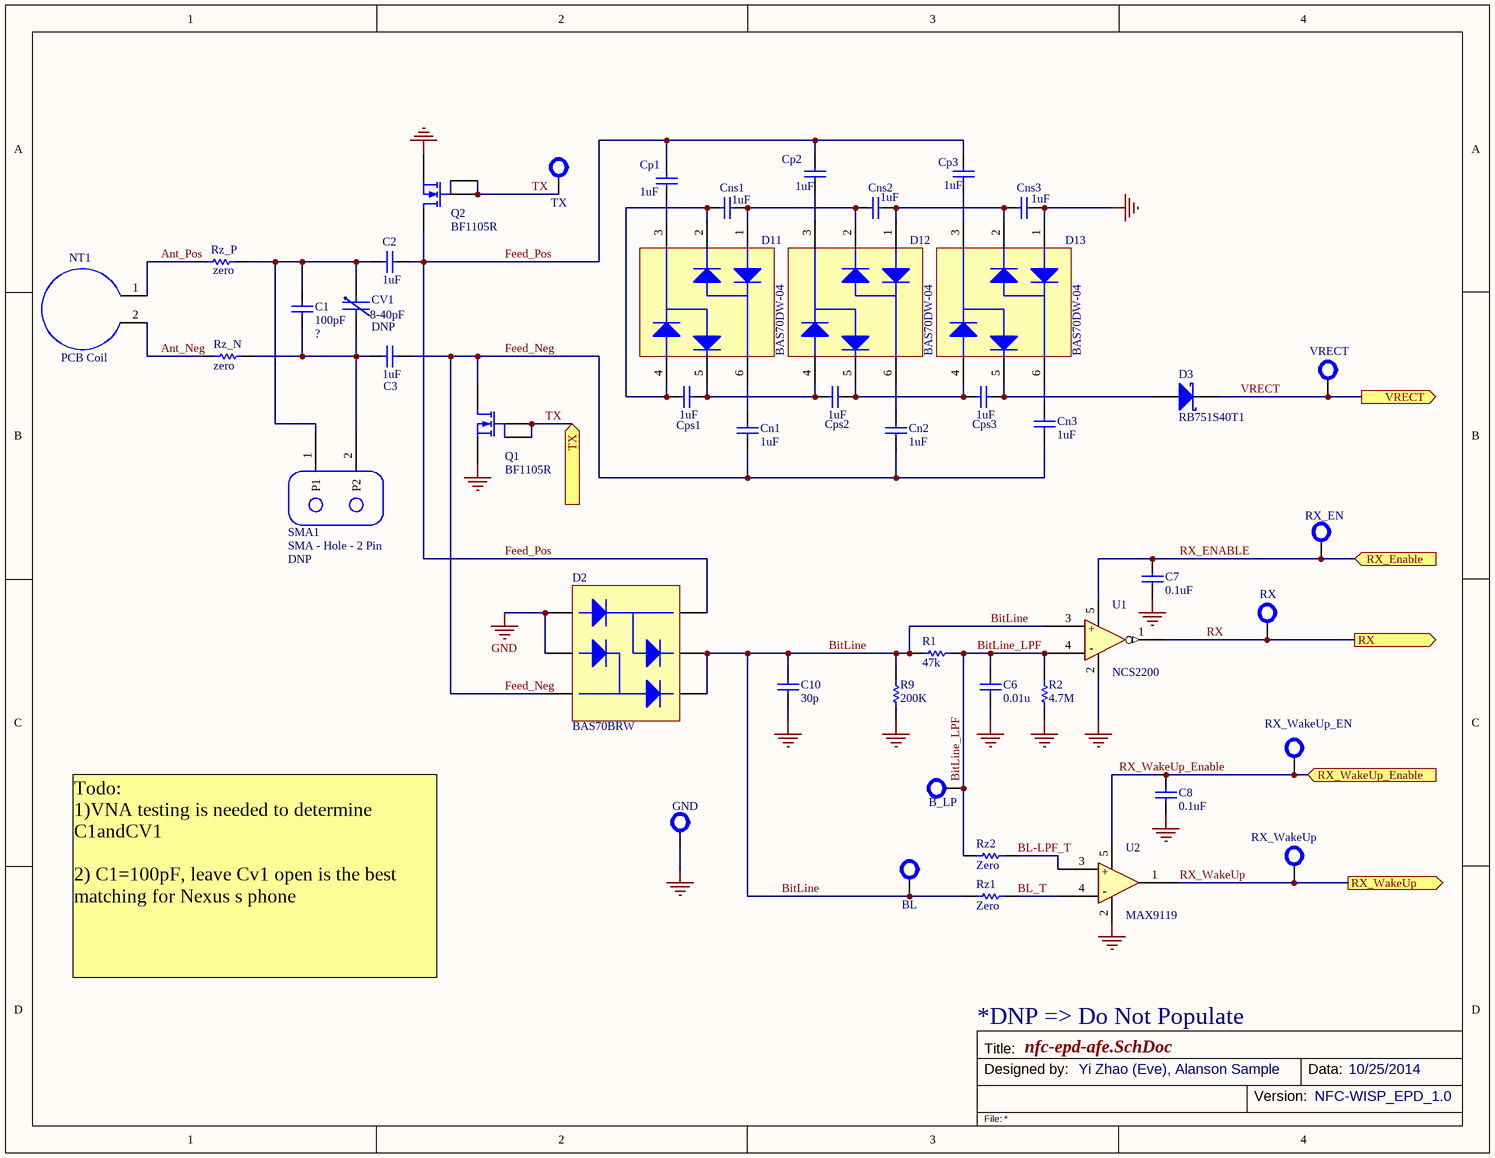
[diagram p4: nfc-epd-afe.SchDoc]

### Parts
B_LP  Test Point  [Test Point - Small]  (value not drawn)
BL  Test Point  [Test Point - Small]  (value not drawn)
C1  Note: 100pF  [0603]  (hidden comment: Cap)
C2  value 1uF  [0603]  (hidden comment: Cap)
C3  value 1uF  [0603]  (hidden comment: Cap)
C6  value 0.01u  [0603]  (hidden comment: Cap)
C7  value 0.1uF  [0603]  (hidden comment: Cap)
C8  value 0.1uF  [0603]  (hidden comment: Cap)
C10  value 30p  [0603]  (hidden comment: Cap)
Cn1  value 1uF  [0603]  (hidden comment: Cap)
Cn2  value 1uF  [0603]  (hidden comment: Cap)
Cn3  value 1uF  [0603]  (hidden comment: Cap)
Cns1  value 1uF  [0603]  (hidden comment: Cap)
Cns2  value 1uF  [0603]  (hidden comment: Cap)
Cns3  value 1uF  [0603]  (hidden comment: Cap)
Cp1  value 1uF  [0603]  (hidden comment: Cap)
Cp2  value 1uF  [0603]  (hidden comment: Cap)
Cp3  value 1uF  [0603]  (hidden comment: Cap)
Cps1  value 1uF  [0603]  (hidden comment: Cap)
Cps2  value 1uF  [0603]  (hidden comment: Cap)
Cps3  value 1uF  [0603]  (hidden comment: Cap)
CV1  value 8-40pF  Note: DNP  [Var-Cap - GKY40056]  (hidden comment: GKY40056)
D2  BAS70BRW  [SOT-363]
D3  RB751S40T1  [SOD-523]
D11  BAS70DW-04  [SOT-363]
D12  BAS70DW-04  [SOT-363]
D13  BAS70DW-04  [SOT-363]
GND0  GND  [Test Point - Small]
NT1  PCB Coil  [Net Tie - 50mil]  (net tie, no BOM)
Q1  BF1105R  [SOT-143R]
Q2  BF1105R  [SOT-143R]
R1  value 47k  [0603]  (hidden comment: Res)
R2  value 4.7M  [0603]  (hidden comment: Res)
R9  value 200K  [0603]  (hidden comment: Res)
RX  Test Point  [Test Point - Small]  (value not drawn)
RX_EN  Test Point  [Test Point - Small]  (value not drawn)
RX_WakeUp  Test Point  [Test Point - Small]  (value not drawn)
RX_WakeUp_EN  Test Point  [Test Point - Small]  (value not drawn)
Rz1  value Zero  [0603]  (hidden comment: Res)
Rz2  value Zero  [0603]  (hidden comment: Res)
Rz_N  value zero  [0603]  (hidden comment: Res)
Rz_P  value zero  [0603]  (hidden comment: Res)
SMA1  SMA - Hole - 2 Pin  Note: DNP  [SMA - Hole - 2 Pin]
TX  Test Point  [Test Point - Small]  (value not drawn)
U1  NCS2200  [SC70-5]
U2  MAX9119  [SC70-5]
VRECT  Test Point  [Test Point - Small]  (value not drawn)

### Ports
RX (out), RX_Enable (in), RX_WakeUp (out), RX_WakeUp_Enable (in), TX (in), VRECT (out)

### Nets
GND: C6.2 C7.2 C8.2 C10.2 Cns3.1 D2.1(A1) D2.2(A2) D13.1(A1) GND0.0 Q1.1(S) Q2.1(S) R2.2 R9.2 U1.2(Gnd) U2.2(VEE)
Ant_Neg: NT1.2(N2) Rz_N.1
Ant_Pos: NT1.1(N1) Rz_P.1
BitLine: BL.0 C10.1 D2.4(C2) D2.5(C1) R1.1 R9.1 Rz1.1 U1.3(IN+)
BitLine_LPF: B_LP.0 C6.1 R1.2 R2.1 Rz2.1 U1.4(In-)
BL-LPF_T: Rz2.2 U2.3(IN+)
BL_T: Rz1.2 U2.4(In-)
Feed_Neg: C3.2 Cn1.1 Cn2.1 Cn3.1 D2.3(AC2) Q1.2(D)
Feed_Pos: C2.2 Cp1.2 Cp2.2 Cp3.2 D2.6(AC1) Q2.2(D)
RX: RX.0 U1.1(OUT) ; port RX
RX_ENABLE: C7.1 RX_EN.0 U1.5(VDD) ; port RX_Enable
RX_WakeUp: RX_WakeUp.0 U2.1(OUT) ; port RX_WakeUp
RX_WakeUp_Enable: C8.1 RX_WakeUp_EN.0 U2.5(VCC) ; port RX_WakeUp_Enable
TX: Q1.3(G) Q1.4(G) Q2.3(G) Q2.4(G) TX.0 ; port TX
VRECT: D3.2(C) VRECT.0 ; port VRECT
NetC1_1: C1.1 C2.1 CV1.1 Rz_P.2 SMA1.1(P1)
NetC1_2: C1.2 C3.1 CV1.2 Rz_N.2 SMA1.2(P2)
NetCn1_2: Cn1.2 D11.6(AC)
NetCn2_2: Cn2.2 D12.6(AC)
NetCn3_2: Cn3.2 D13.6(AC)
NetCns1_1: Cns1.1 Cns2.2 D11.1(A1) D12.2(C1)
NetCns1_2: Cns1.2 Cps1.2 D11.2(C1) D11.4(A2)
NetCns2_1: Cns2.1 Cns3.2 D12.1(A1) D13.2(C1)
NetCp1_1: Cp1.1 D11.3(AC2)
NetCp2_1: Cp2.1 D12.3(AC2)
NetCp3_1: Cp3.1 D13.3(AC2)
NetCps1_1: Cps1.1 Cps2.2 D11.5(C2) D12.4(A2)
NetCps2_1: Cps2.1 Cps3.2 D12.5(C2) D13.4(A2)
NetCps3_1: Cps3.1 D3.1(A) D13.5(C2)

### Notes on the sheet
- Todo:
  1)VNA testing is needed to determine C1andCV1
  2) C1=100pF, leave Cv1 open is the best matching for Nexus s phone
- *DNP => Do Not Populate
- Title:
- Designed by:
- Yi Zhao (Eve), Alanson Sample
- Version:
- Data:
- NFC-WISP_EPD_1.0
- 10/25/2014
- File:
- (in symbol MAX9119) +; -
- (in symbol NCS2200) +; -

### Library data of the parts
B_LP BL GND0 RX RX_EN RX_WakeUp RX_WakeUp_EN TX VRECT = Test Point: as Con_Batt on sheet nfc-epd-power; Digi-Key Part Number: Example: 5000K-ND, 5012K-ND, Surface mount 5015KCT-ND; Rating: *; Value: *
  B_LP BL RX RX_EN RX_WakeUp RX_WakeUp_EN TX: Note: *
C1 C6-C8 C10 = Cap: as C31 on sheet nfc-epd-mcu; Digi-Key Part Number: *; Manufacturer Part Number: *; Rating: *
  C1: Value: ?
  C6: Note: *; Supplier 1: Digi-Key; Supplier Part Number 1: 490-1512-1-ND
  C7 C8 C10: Note: *
C2 C3 Cn1-Cn3 Cns1-Cns3 Cp1-Cp3 Cps1-Cps3 = Cap: as C20 on sheet nfc-epd-power; Digi-Key Part Number: *; Note: *; Rating: *; Supplier Part Number 1: 478-1251-1-1ND; Supplier 1: Digikey
  Cp1: Supplier 1: Digi-Key; Supplier Part Number 1: 478-1251-1-ND
  Cps1: 478-1251-1-1ND: 478-1251-1-1ND
CV1 = Var-Cap/603: Var-Cap Sprague-Goodman GKY40056; Digi-Key Part Number: SG9013CT-ND; Manufacturer Part Number: GKY40056; Manufacturer: Sprague-Goodman; Rating: *
D2 = Diode - Array_2: Diode Array - 2 Pair Series Connection; Manufacturer: Diodes Inc; Manufacturer Part Number: BAS70BRW-7-F; Note: *; Digi-Key Part Number: BAS70BRW-7FDICT-ND; Value: *; Rating: *
D3 = RB751S40T1: Schottky Diode; Published: 8-Jun-2000; LatestRevisionDate: 17-Jul-2002; LatestRevisionNote: Re-released for DXP Platform.; PackageReference: SMB; Publisher: Altium Limited; Code_JEDEC: DO-214-AA; Supplier 1: Digi-Key; Supplier Part Number 1: RB751S40T1GOSCT-ND
D11-D13 = Diode - Array_2_1: Diode Array - 2 Pair Series Connection; Manufacturer: Diodes Inc; Manufacturer Part Number: BAS70DW-04-7-F; Note: *; Digi-Key Part Number: BAS70DW-04FDICT-ND; Value: *; Rating: *; Supplier 1: Digi-Key; Supplier Part Number 1: BAS70DW-04FDICT-ND
NT1 = Net Tie - Coil: Hand draw coil symbol based on a 'Net Tie'; Note: A Net Tie is an element that allows two differnt nets to be connected (shorted) together.
Q1 Q2 = BF1105R: SOT-143R, N-Channel Dual-Gate Mos-Fets MOSFET; Manufacturer Part Number: BF1105R,215; Manufacturer: NXP Semiconductors; Rating: *; Value: *; Note: *; Supplier 1: Mouser; Supplier Part Number 1: 771-BF1105R,215
  Q1: Digi-Key Part Number: BF1105R,215-ND
R1 R2 R9 = Res: as R31 on sheet nfc-epd-mcu; Manufacturer Part Number: *; Digi-Key Part Number: *; Rating: *
Rz1 Rz2 Rz_N Rz_P = Res: as Rz0 on sheet nfc-epd-power; Digi-Key Part Number: *; Rating: *; Supplier 1: Digi-Key; Supplier Part Number 1: 311-0.0HRCT-ND
  Rz_N Rz_P: Note: *
SMA1 = SMA - Hole - 2 Pin: Two pin SMA connector wisp
U1 = NCS2200: Comparator: On Semi 10uA Comparator; Manufacturer: ON Semiconductor; Manufacturer Part Number: NCS2200SQ2T2G; Digi-Key Part Number: NCS2200SQ2T2GOSTR-ND; Rating: *; Value: *; Note: *; Supplier 1: Digi-Key; Supplier Part Number 1: NCS2200SQ2T2GOSCT-ND
U2 = MAX9119: IC COMPARATOR BTR SC70-5, 350nA; Manufacturer: Maxim Integrated; Manufacturer Part Number: MAX9119EXK+T; Digi-Key Part Number: MAX9119EXK+TCT-ND; Rating: *; Value: *; Note: *; Supplier 1: Digi-Key; Supplier Part Number 1: MAX9119EXK+TCT-ND

## Sheet nfc-epd-eink.SchDoc
size Letter
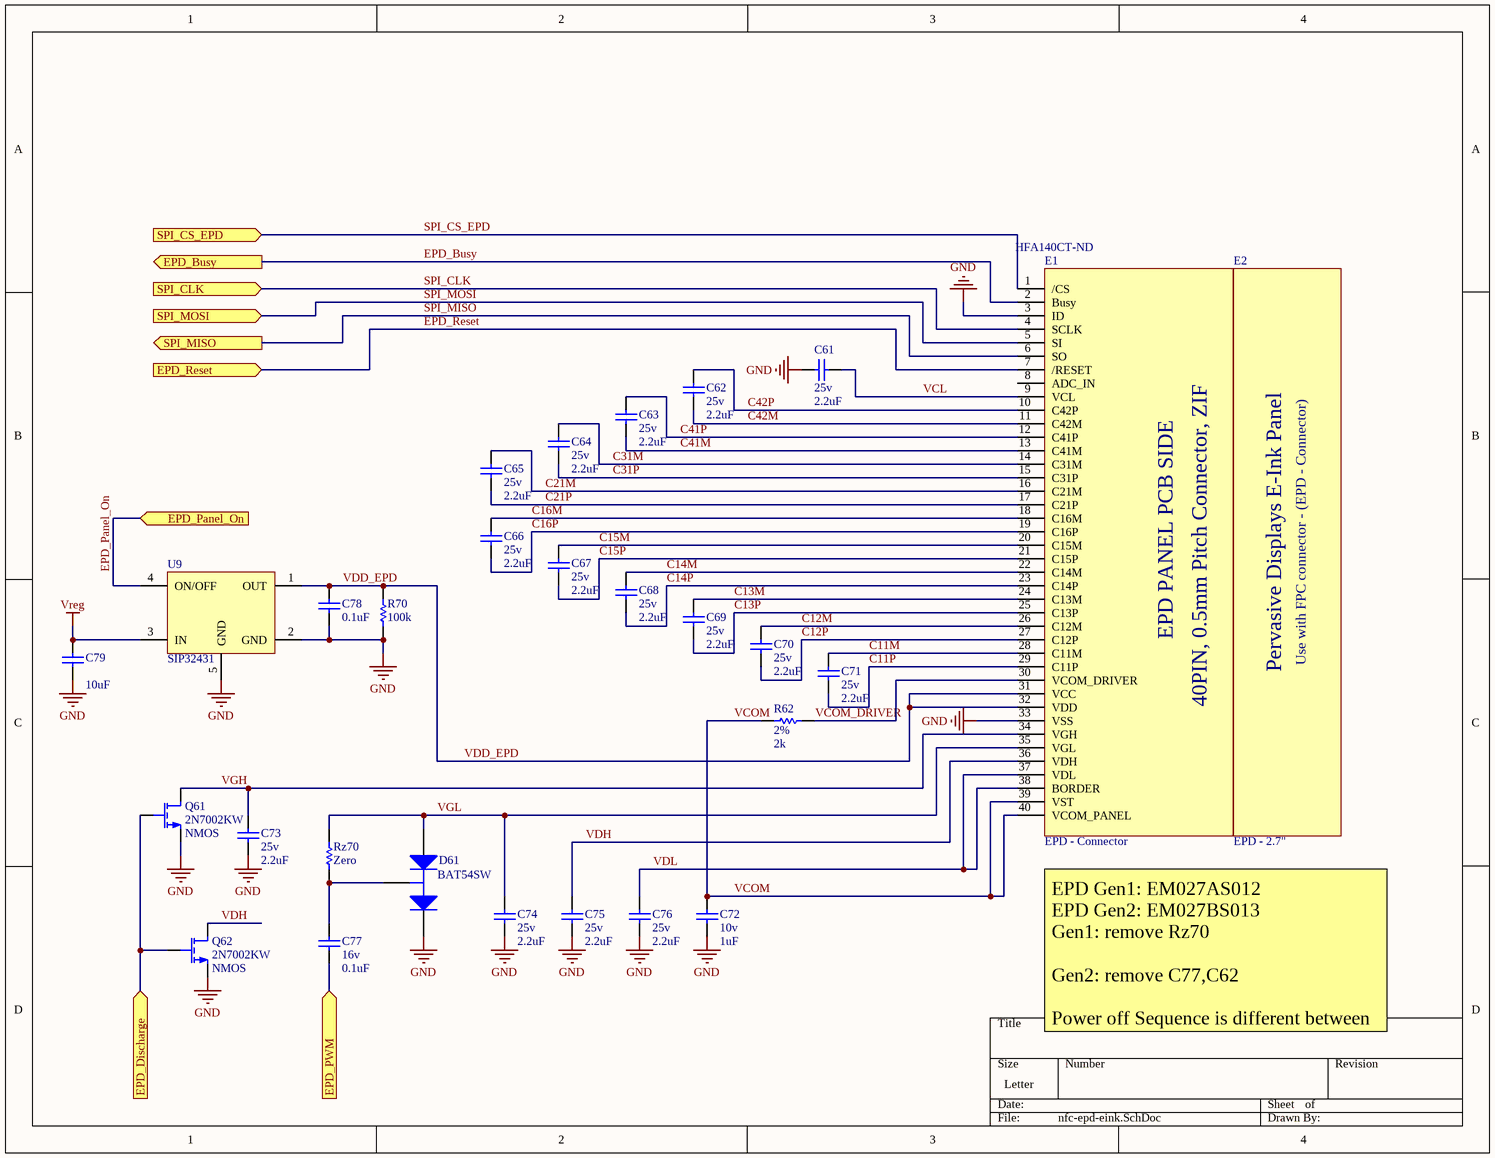
[diagram p5: nfc-epd-eink.SchDoc]

### Parts
C61  value 2.2uF  Rating: 25v  [0402]  (hidden comment: Cap)
C62  value 2.2uF  Rating: 25v  [0402]  (hidden comment: Cap)
C63  value 2.2uF  Rating: 25v  [0402]  (hidden comment: Cap)
C64  value 2.2uF  Rating: 25v  [0402]  (hidden comment: Cap)
C65  value 2.2uF  Rating: 25v  [0402]  (hidden comment: Cap)
C66  value 2.2uF  Rating: 25v  [0402]  (hidden comment: Cap)
C67  value 2.2uF  Rating: 25v  [0402]  (hidden comment: Cap)
C68  value 2.2uF  Rating: 25v  [0402]  (hidden comment: Cap)
C69  value 2.2uF  Rating: 25v  [0402]  (hidden comment: Cap)
C70  value 2.2uF  Rating: 25v  [0402]  (hidden comment: Cap)
C71  value 2.2uF  Rating: 25v  [0402]  (hidden comment: Cap)
C72  value 1uF  Rating: 10v  [0603]  (hidden comment: Cap)
C73  value 2.2uF  Rating: 25v  [0603]  (hidden comment: Cap)
C74  value 2.2uF  Rating: 25v  [0603]  (hidden comment: Cap)
C75  value 2.2uF  Rating: 25v  [0603]  (hidden comment: Cap)
C76  value 2.2uF  Rating: 25v  [0603]  (hidden comment: Cap)
C77  value 0.1uF  Rating: 16v  [0603]  (hidden comment: Cap)
C78  value 0.1uF  [0603]  (hidden comment: Cap)
C79  value 10uF  [0603]  (hidden comment: Cap)
D61  BAT54SW  [SOT-323 / SC-70]
E1  EPD - Connector  Supplier Part Number 1: HFA140CT-ND  [EPD - Connector]
E2  EPD - 2.7"  [EPD - EM027AS012]
Q61  2N7002KW  value NMOS  [SOT-323 / SC-70]
Q62  2N7002KW  value NMOS  [SOT-323 / SC-70]
R62  value 2k  Rating: 2%  [0603]  (hidden comment: Res)
R70  value 100k  [0603]  (hidden comment: Res)
Rz70  value Zero  [0603]  (hidden comment: Res)
U9  SIP32431  [TDFN-4]

### Ports
EPD_Busy (out), EPD_Discharge (in), EPD_Panel_On (in), EPD_PWM (in), EPD_Reset (in), SPI_CLK (in), SPI_CS_EPD (in), SPI_MISO (out), SPI_MOSI (in)

### Nets
GND: C61.2 C72.1 C73.1 C74.1 C75.1 C76.1 C78.1 C79.1 D61.2(K) E1.3(ID) E1.33(VSS) Q61.2(S) Q62.2(S) R70.1 U9.2(GND) U9.5(GND)
Vreg: C79.2 U9.3(IN)
C11M: C71.2 E1.28(C11M)
C11P: C71.1 E1.29(C11P)
C12M: C70.1 E1.26(C12M)
C12P: C70.2 E1.27(C12P)
C13M: C69.2 E1.24(C13M)
C13P: C69.1 E1.25(C13P)
C14M: C68.2 E1.22(C14M)
C14P: C68.1 E1.23(C14P)
C15M: C67.2 E1.20(C15M)
C15P: C67.1 E1.21(C15P)
C16M: C66.2 E1.18(C16M)
C16P: C66.1 E1.19(C16P)
C21M: C65.2 E1.16(C21M)
C21P: C65.1 E1.17(C21P)
C31M: C64.2 E1.14(C31M)
C31P: C64.1 E1.15(C31P)
C41M: C63.1 E1.13(C41M)
C41P: C63.2 E1.12(C41P)
C42M: C62.2 E1.11(C42M)
C42P: C62.1 E1.10(C42P)
EPD_Busy: E1.2(Busy) ; port EPD_Busy
EPD_Discharge: Q61.1(G) Q62.1(G) ; port EPD_Discharge
EPD_Panel_On: U9.4(ON/OFF) ; port EPD_Panel_On
EPD_PWM: C77.1 ; port EPD_PWM
EPD_Reset: E1.7(/RESET) ; port EPD_Reset
SPI_CLK: E1.4(SCLK) ; port SPI_CLK
SPI_CS_EPD: E1.1(/CS) ; port SPI_CS_EPD
SPI_MISO: E1.6(SO) ; port SPI_MISO
SPI_MOSI: E1.5(SI) ; port SPI_MOSI
VCL: C61.1 E1.9(VCL)
VCOM: C72.2 E1.39(VST) E1.40(VCOM_PANEL) R62.2
VCOM_DRIVER: E1.30(VCOM_DRIVER) R62.1
VDD_EPD: C78.2 E1.31(VCC) E1.32(VDD) R70.2 U9.1(OUT)
VDH: C75.2 E1.36(VDH) Q62.3(D)
VDL: C76.2 E1.37(VDL) E1.38(BORDER)
VGH: C73.2 E1.34(VGH) Q61.3(D)
VGL: C74.2 D61.1(A) E1.35(VGL) Rz70.1
NetC77_2: C77.2 D61.3(C) Rz70.2

Not connected (* = marked no-connect by the designer): E1 8(ADC_IN)

### Notes on the sheet
- EPD Gen1: EM027AS012
  EPD Gen2: EM027BS013
  Gen1: remove Rz70
  Gen2: remove C77,C62
  Power off Sequence is different between Gen1 and  Gen2 EPD
- (in symbol EPD - Connector) EPD PANEL PCB SIDE; 40PIN, 0.5mm Pitch Connector, ZIF
- (in symbol EPD - Display EM027AS012) Pervasive Displays E-Ink Panel; Use with FPC connector - (EPD - Connector)

### Library data of the parts
C61-C76 C78 C79 = Cap: as C31 on sheet nfc-epd-mcu; Digi-Key Part Number: *; Manufacturer Part Number: *; Note: *
  C72: Supplier 1: Digi-Key; Supplier Part Number 1: 478-1251-1-ND
C77 = Cap: Ceramic Capacitor (Surface Mount); Manufacturer: Generic Ceramic Chip Cap (TBD); Note: DNP for Gen2 EPD; Digi-Key Part Number: *; Manufacturer Part Number: *
D61 = Diode - Array_1: Diode Array, Two in Series, Small Package SOT-323; Manufacturer: ON Semiconductor; Manufacturer Part Number: BAT54SWT1G; Note: *; Digi-Key Part Number: BAT54SWT1GOSCT-ND or (BAT54SW); Value: *; Rating: *
E1 = EPD - Connector: FPC, 40pin, 0.5mm Pitch - ZIF; Manufacturer: Hirose Electric Co Ltd; Manufacturer Part Number: FH12-40S-0.5SH or FH12S-40S-0.5SH; Digi-Key Part Number: HFJ140CT-ND or HFA140CT-ND; Note: *; Value: *; Rating: *; Supplier 1: Digi-Key
E2 = EPD - Display EM027AS012: 2.7" TFT EPD Panel, STARCONN 089H40 variant; Manufacturer: PERVASIVE DISPLAYS, INC; Note: Use for alignment purposes. No solder pads in footprint.; Digi-Key Part Number: EA-LCD-009-ND (should find another supplyer); Manufacturer Part Number: EM027AS012; Rating: *; Value: *
Q61 Q62 = MOSFET-N: N-Channel MOSFET; Manufacturer: Fairchild Semiconductor; Digi-Key Part Number: 2N7002KWCT-ND; Manufacturer Part Number: 2N7002KW; Notes: *; Rating: *; Supplier 1: Digi-Key; Supplier Part Number 1: 2N7002KWCT-ND
R62 R70 = Res: as R31 on sheet nfc-epd-mcu; Manufacturer Part Number: *; Digi-Key Part Number: *; Note: *
  R70: Rating: *
Rz70 = Res: as Rz0 on sheet nfc-epd-power; Digi-Key Part Number: *; Rating: *; Supplier 1: Digi-Key; Supplier Part Number 1: 311-0.0HRCT-ND
U9 = SIP32431: High Sside Switch - 4TDFN package; Manufacturer: Vishay Siliconix; Manufacturer Part Number: SIP32431DNP3-T1GE4; Digi-Key Part Number: SIP32431DNP3-T1GE4CT-ND; Note: *; Value: *; Rating: *

## Nets that join several sheets
GND: nfc-epd-mcu (22 pins), nfc-epd-sensors (9 pins), nfc-epd-power (19 pins), nfc-epd-afe (15 pins), nfc-epd-eink (16 pins)
Vreg: nfc-epd-mcu (11 pins), nfc-epd-sensors (Rz44.1 Rz46.1), nfc-epd-power (6 pins), nfc-epd-eink (C79.2 U9.3)
ACCEL_INT1: nfc-epd-mcu (P35.7 U32.21), nfc-epd-sensors (Rz49.2)
ACCEL_INT2: nfc-epd-mcu (P35.9 U32.20), nfc-epd-sensors (Rz48.2)
Batt_Full: nfc-epd-mcu (P35.6 U32.19), nfc-epd-power (Rz22.1)
BATT_MEAS: nfc-epd-mcu (P36.2 U32.3), nfc-epd-sensors (Rz41.1)
BATT_MEAS_ENABLE: nfc-epd-mcu (P36.3 U32.5), nfc-epd-sensors (Rz40.2)
EPD_Busy: nfc-epd-mcu (U32.25), nfc-epd-eink (E1.2)
EPD_Discharge: nfc-epd-mcu (U32.26), nfc-epd-eink (Q61.1 Q62.1)
EPD_Panel_On: nfc-epd-mcu (U32.23), nfc-epd-eink (U9.4)
EPD_PWM: nfc-epd-mcu (P35.5 U32.18), nfc-epd-eink (C77.1)
EPD_Reset: nfc-epd-mcu (U32.24), nfc-epd-eink (E1.7)
RX: nfc-epd-mcu (P35.4 U32.17), nfc-epd-afe (RX.0 U1.1)
RX_ENABLE: nfc-epd-mcu (U32.2), nfc-epd-afe (C7.1 RX_EN.0 U1.5)
RX_WakeUp: nfc-epd-mcu (P35.3 U32.16), nfc-epd-afe (RX_WakeUp.0 U2.1)
RX_WakeUp_Enable: nfc-epd-mcu (U32.1), nfc-epd-afe (C8.1 RX_WakeUp_EN.0 U2.5)
SPI_CLK: nfc-epd-mcu (P31.5 U32.32), nfc-epd-sensors (U42.6 U44.4), nfc-epd-eink (E1.4)
SPI_CS_ACCEL: nfc-epd-mcu (P35.8 U32.4), nfc-epd-sensors (Rz47.1)
SPI_CS_EPD: nfc-epd-mcu (U32.35), nfc-epd-eink (E1.1)
SPI_CS_Mem: nfc-epd-mcu (P31.2 U32.29), nfc-epd-sensors (Rz45.1)
SPI_MISO: nfc-epd-mcu (P31.6 U32.31), nfc-epd-sensors (U42.2 U44.7), nfc-epd-eink (E1.6)
SPI_MOSI: nfc-epd-mcu (P31.4 U32.30), nfc-epd-sensors (U42.5 U44.6), nfc-epd-eink (E1.5)
TX: nfc-epd-mcu (U32.36), nfc-epd-afe (5 pins)
VRECT: nfc-epd-mcu (P36.4), nfc-epd-sensors (Rz43.1), nfc-epd-power (12 pins), nfc-epd-afe (D3.2 VRECT.0)
VRECT_Low: nfc-epd-mcu (U32.22), nfc-epd-power (U26.1)